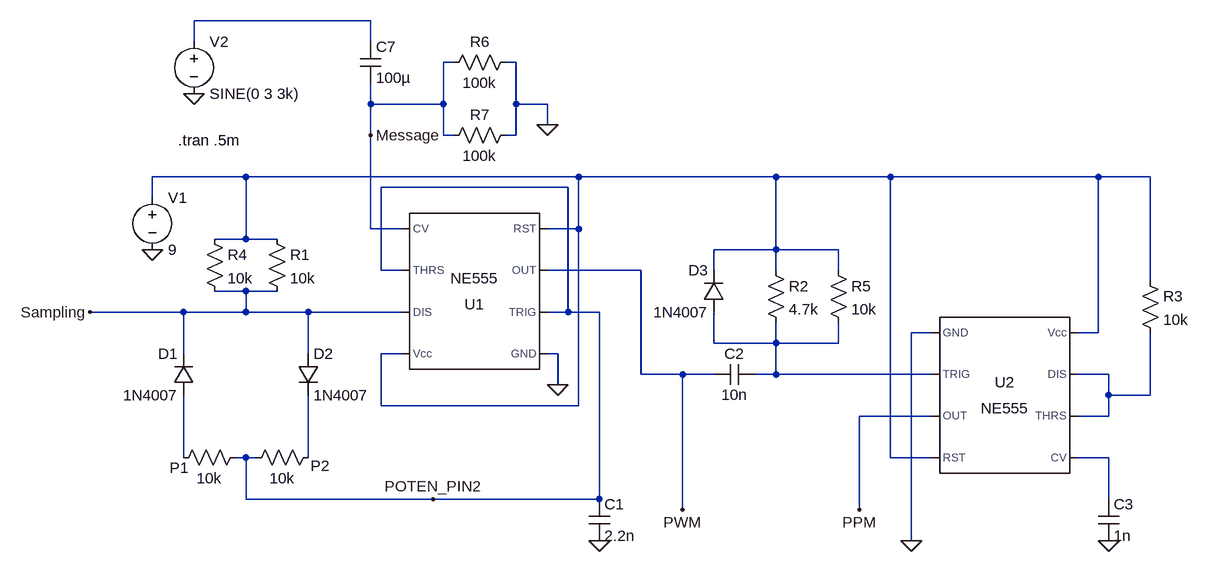
[diagram p0: schematic PWM_PPM_Modulation_Circuit.asc]
PWM_PPM_Modulation_Circuit.asc, the LTspice schematic file:
Version 4.1
SHEET 1 3432 680
WIRE -128 -432 -400 -432
WIRE -400 -400 -400 -432
WIRE -128 -400 -128 -432
WIRE 0 -368 -16 -368
WIRE 96 -368 80 -368
WIRE -128 -304 -128 -336
WIRE -16 -304 -16 -368
WIRE -16 -304 -128 -304
WIRE 96 -304 96 -368
WIRE 144 -304 96 -304
WIRE 144 -272 144 -304
WIRE -128 -256 -128 -304
WIRE -16 -256 -16 -304
WIRE 0 -256 -16 -256
WIRE 96 -256 96 -304
WIRE 96 -256 80 -256
WIRE -320 -192 -464 -192
WIRE 192 -192 -320 -192
WIRE 496 -192 192 -192
WIRE 672 -192 496 -192
WIRE 992 -192 672 -192
WIRE 1072 -192 992 -192
WIRE 176 -176 -112 -176
WIRE -464 -160 -464 -192
WIRE -128 -112 -128 -256
WIRE -80 -112 -128 -112
WIRE 192 -112 192 -192
WIRE 192 -112 144 -112
WIRE -320 -96 -320 -192
WIRE -320 -96 -368 -96
WIRE -272 -96 -320 -96
WIRE 496 -80 496 -192
WIRE 496 -80 400 -80
WIRE 592 -80 496 -80
WIRE -112 -48 -112 -176
WIRE -80 -48 -112 -48
WIRE 288 -48 144 -48
WIRE 400 -48 400 -80
WIRE 496 -48 496 -80
WIRE 592 -48 592 -80
WIRE 1072 -32 1072 -192
WIRE -320 -16 -368 -16
WIRE -272 -16 -320 -16
WIRE -416 16 -560 16
WIRE -320 16 -320 -16
WIRE -320 16 -416 16
WIRE -224 16 -320 16
WIRE -80 16 -224 16
WIRE 176 16 176 -176
WIRE 176 16 144 16
WIRE 224 16 176 16
WIRE 736 48 704 48
WIRE 992 48 992 -192
WIRE 992 48 960 48
WIRE 400 64 400 16
WIRE 496 64 496 32
WIRE 496 64 400 64
WIRE 592 64 592 32
WIRE 592 64 496 64
WIRE -416 80 -416 16
WIRE -224 80 -224 16
WIRE -80 80 -112 80
WIRE 160 80 144 80
WIRE 288 112 288 -48
WIRE 352 112 288 112
WIRE 400 112 352 112
WIRE 496 112 496 64
WIRE 496 112 464 112
WIRE 736 112 496 112
WIRE 1008 112 960 112
WIRE 160 128 160 80
WIRE 1008 144 1008 112
WIRE 1072 144 1072 48
WIRE 1072 144 1008 144
WIRE -112 160 -112 80
WIRE 192 160 192 -112
WIRE 192 160 -112 160
WIRE 736 176 624 176
WIRE 1008 176 1008 144
WIRE 1008 176 960 176
WIRE -416 240 -416 144
WIRE -320 240 -336 240
WIRE -304 240 -320 240
WIRE -224 240 -224 144
WIRE 672 240 672 -192
WIRE 736 240 672 240
WIRE 1008 240 960 240
WIRE -320 304 -320 240
WIRE -32 304 -320 304
WIRE 224 304 224 16
WIRE 224 304 -32 304
WIRE 1008 304 1008 240
WIRE 352 320 352 112
WIRE 624 320 624 176
WIRE 704 368 704 48
FLAG 160 128 0
FLAG 224 368 0
FLAG -464 -80 0
FLAG 1008 368 0
FLAG 704 368 0
FLAG 624 320 PPM
FLAG -32 304 POTEN_PIN2
FLAG -400 -320 0
FLAG 352 320 PWM
FLAG -560 16 Sampling
FLAG -128 -256 Message
FLAG 144 -272 0
SYMBOL Misc\\NE555 32 -16 R180
SYMATTR InstName U1
SYMBOL diode -400 144 R180
WINDOW 0 24 64 Left 2
WINDOW 3 24 0 Left 2
SYMATTR InstName D1
SYMATTR Value 1N4007
SYMBOL diode -240 80 R0
SYMATTR InstName D2
SYMATTR Value 1N4007
SYMBOL res -320 224 R90
WINDOW 0 47 103 VBottom 2
WINDOW 3 32 56 VTop 2
SYMATTR InstName P1
SYMATTR Value 10k
SYMBOL res -208 224 R90
WINDOW 0 44 -2 VBottom 2
WINDOW 3 32 56 VTop 2
SYMATTR InstName P2
SYMATTR Value 10k
SYMBOL cap 208 304 R0
SYMATTR InstName C1
SYMATTR Value 2.2n
SYMBOL voltage -464 -176 R0
WINDOW 123 0 0 Left 0
WINDOW 39 0 0 Left 0
SYMATTR InstName V1
SYMATTR Value 9
SYMBOL cap 464 96 R90
WINDOW 0 0 32 VBottom 2
WINDOW 3 32 32 VTop 2
SYMATTR InstName C2
SYMATTR Value 10n
SYMBOL diode 416 16 R180
WINDOW 0 24 64 Left 2
WINDOW 3 24 0 Left 2
SYMATTR InstName D3
SYMATTR Value 1N4007
SYMBOL res 480 -64 R0
SYMATTR InstName R2
SYMATTR Value 4.7k
SYMBOL res 1056 -48 R0
SYMATTR InstName R3
SYMATTR Value 10k
SYMBOL Misc\\NE555 848 144 R0
SYMATTR InstName U2
SYMBOL cap 992 304 R0
SYMATTR InstName C3
SYMATTR Value 1n
SYMBOL res -384 -112 R0
SYMATTR InstName R4
SYMATTR Value 10k
SYMBOL res 576 -64 R0
SYMATTR InstName R5
SYMATTR Value 10k
SYMBOL cap -144 -400 R0
SYMATTR InstName C7
SYMATTR Value 100µ
SYMBOL voltage -400 -416 R0
WINDOW 123 0 0 Left 0
WINDOW 39 0 0 Left 0
SYMATTR InstName V2
SYMATTR Value SINE(0 3 3k)
SYMBOL res -288 -112 R0
SYMATTR InstName R1
SYMATTR Value 10k
SYMBOL res 96 -384 R90
WINDOW 0 0 56 VBottom 2
WINDOW 3 32 56 VTop 2
SYMATTR InstName R6
SYMATTR Value 100k
SYMBOL res 96 -272 R90
WINDOW 0 0 56 VBottom 2
WINDOW 3 32 56 VTop 2
SYMATTR InstName R7
SYMATTR Value 100k
TEXT -424 -248 Left 2 !.tran .5m

The netlist it stands for:
* PWM_PPM_Modulation_Circuit.asc
X§U1 0 POTEN_PIN2 PWM N002 Message POTEN_PIN2 Sampling N002 NE555  ; pins GND TRIG OUT RST CV THRS DIS Vcc
D1 N005 Sampling 1N4007
D2 Sampling N006 1N4007
R§P1 POTEN_PIN2 N005 10k
R§P2 N006 POTEN_PIN2 10k
C1 POTEN_PIN2 0 2.2n
V1 N002 0 9
C2 N003 PWM 10n
D3 N003 N002 1N4007
R2 N002 N003 4.7k
R3 N002 N004 10k
X§U2 0 N003 PPM N002 N007 N004 N004 N002 NE555  ; pins GND TRIG OUT RST CV THRS DIS Vcc
C3 N007 0 1n
R4 N002 Sampling 10k
R5 N002 N003 10k
C7 N001 Message 100µ
V2 N001 0 SINE(0 3 3k)
R1 N002 Sampling 10k
R6 0 Message 100k
R7 0 Message 100k
.model D D
.lib standard.dio
.tran .5m
.lib NE555.sub
.backanno
.end